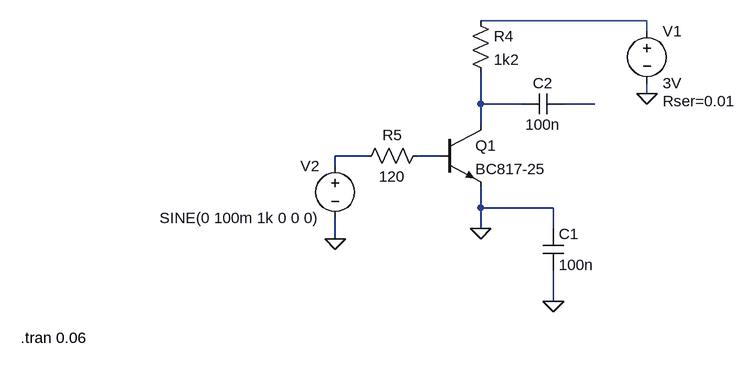
[diagram p0: schematic npn_aplificador.asc]
npn_aplificador.asc, the LTspice schematic file:
Version 4
SHEET 1 880 680
WIRE 464 -32 208 -32
WIRE 464 -16 464 -32
WIRE 464 80 464 64
WIRE 208 96 208 48
WIRE 272 96 208 96
WIRE 384 96 336 96
WIRE 208 128 208 96
WIRE 32 176 -16 176
WIRE 144 176 112 176
WIRE -16 192 -16 176
WIRE 208 256 208 224
WIRE 320 256 208 256
WIRE 208 288 208 256
WIRE 320 288 320 256
WIRE -16 304 -16 272
WIRE 320 400 320 352
FLAG -16 304 0
FLAG 320 400 0
FLAG 464 80 0
FLAG 208 288 0
SYMBOL npn 144 128 R0
SYMATTR InstName Q1
SYMATTR Value BC817-25
SYMBOL cap 304 288 R0
SYMATTR InstName C1
SYMATTR Value 100n
SYMATTR SpiceLine V=6
SYMBOL res 192 -48 R0
SYMATTR InstName R4
SYMATTR Value 1k2
SYMBOL voltage 464 -32 R0
WINDOW 123 0 0 Left 2
WINDOW 39 24 124 Left 2
SYMATTR InstName V1
SYMATTR Value 3V
SYMATTR SpiceLine Rser=0.01
SYMBOL voltage -16 176 M0
WINDOW 123 0 0 Left 2
WINDOW 39 0 0 Left 2
SYMATTR InstName V2
SYMATTR Value SINE(0 100m 1k 0 0 0)
SYMBOL cap 336 80 R90
WINDOW 0 0 32 VBottom 2
WINDOW 3 32 32 VTop 2
SYMATTR InstName C2
SYMATTR Value 100n
SYMATTR SpiceLine V=6
SYMBOL res 128 160 R90
WINDOW 0 0 56 VBottom 2
WINDOW 3 32 56 VTop 2
SYMATTR InstName R5
SYMATTR Value 120
TEXT -500 456 Left 2 !.tran 0.06

The netlist it stands for:
* npn_aplificador.asc
Q1 N002 N005 0 0 BC817-25
C1 0 0 100n V=6
R4 N001 N002 1k2
V1 N001 0 3V Rser=0.01
V2 N004 0 SINE(0 100m 1k 0 0 0)
C2 N003 N002 100n V=6
R5 N005 N004 120
.model NPN NPN
.model PNP PNP
.lib standard.bjt
.tran 0.06
.backanno
.end